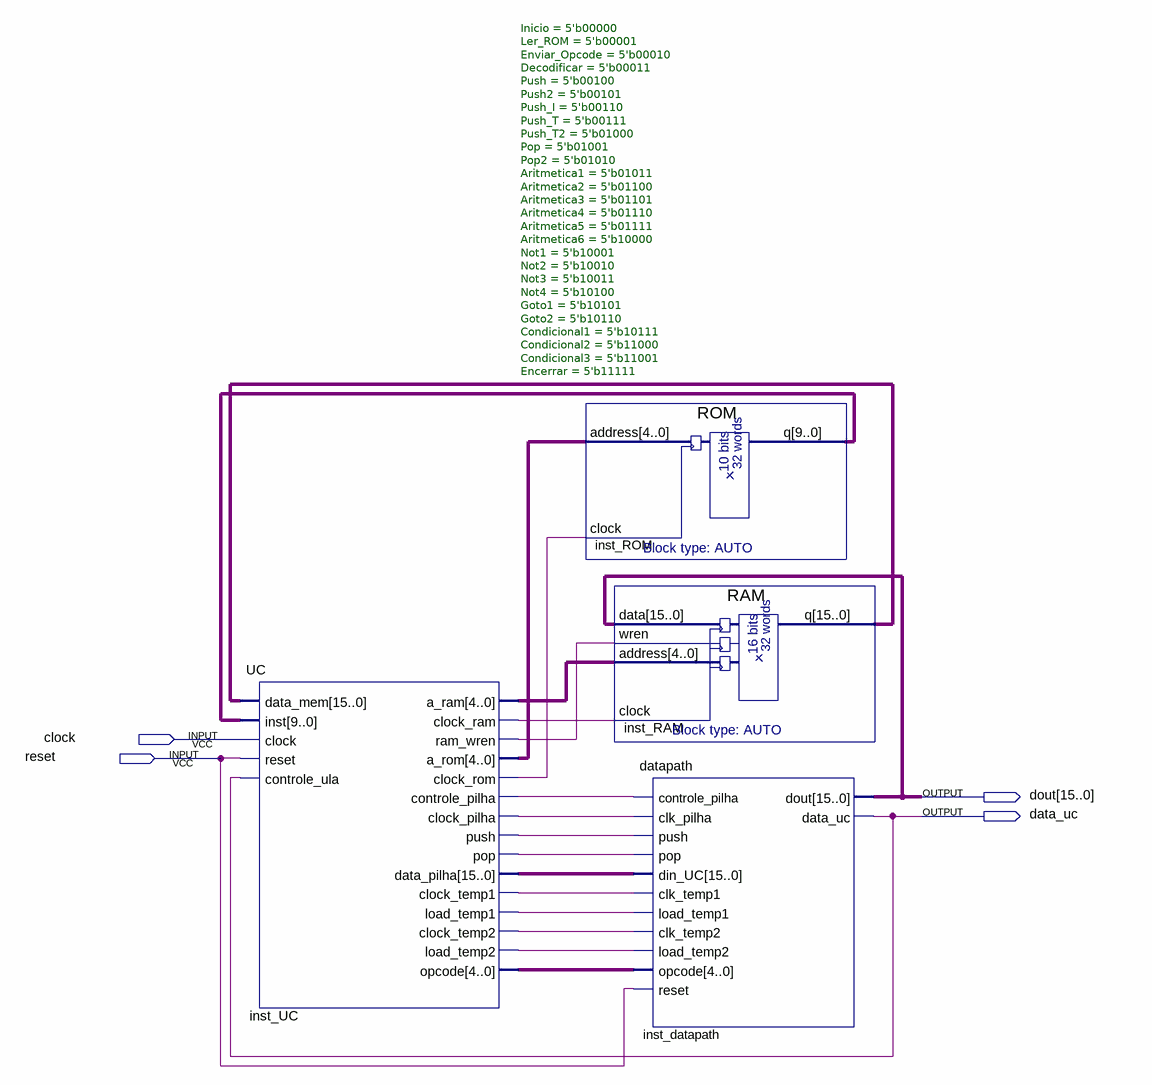
[diagram p0: schematic sheet]
// Quartus schematic processador_blocos.bdf as structural Verilog: 4 symbols, 4 pins
module processador_blocos (
  input  clock,
  input  reset,
  output [15:0] dout,
  output data_uc
);

  wire inst_UC_clock_pilha, inst_UC_clock_ram, inst_UC_clock_rom, inst_UC_clock_temp1, inst_UC_clock_temp2,
       inst_UC_controle_pilha, inst_UC_load_temp1, inst_UC_load_temp2, inst_UC_pop, inst_UC_push,
       inst_UC_ram_wren;
  wire [4:0] inst_UC_a_ram, inst_UC_a_rom, inst_UC_opcode;
  wire [9:0] inst_ROM_q;
  wire [15:0] inst_RAM_q, inst_UC_data_pilha;

  UC #(.Inicio(5'b00000), .Ler_ROM(5'b00001), .Enviar_Opcode(5'b00010), .Decodificar(5'b00011), .Push(5'b00100), .Push2(5'b00101), .Push_I(5'b00110), .Push_T(5'b00111), .Push_T2(5'b01000), .Pop(5'b01001), .Pop2(5'b01010), .Aritmetica1(5'b01011), .Aritmetica2(5'b01100), .Aritmetica3(5'b01101), .Aritmetica4(5'b01110), .Aritmetica5(5'b01111), .Aritmetica6(5'b10000), .Not1(5'b10001), .Not2(5'b10010), .Not3(5'b10011), .Not4(5'b10100), .Goto1(5'b10101), .Goto2(5'b10110), .Condicional1(5'b10111), .Condicional2(5'b11000), .Condicional3(5'b11001), .Encerrar(5'b11111)) inst_UC (
    .data_mem(inst_RAM_q), .inst(inst_ROM_q), .clock(clock), .reset(reset), .controle_ula(data_uc),
    .a_ram(inst_UC_a_ram), .clock_ram(inst_UC_clock_ram), .ram_wren(inst_UC_ram_wren), .a_rom(inst_UC_a_rom),
    .clock_rom(inst_UC_clock_rom), .controle_pilha(inst_UC_controle_pilha),
    .clock_pilha(inst_UC_clock_pilha), .push(inst_UC_push), .pop(inst_UC_pop),
    .data_pilha(inst_UC_data_pilha), .clock_temp1(inst_UC_clock_temp1), .load_temp1(inst_UC_load_temp1),
    .clock_temp2(inst_UC_clock_temp2), .load_temp2(inst_UC_load_temp2), .opcode(inst_UC_opcode));
  ROM inst_ROM (.address(inst_UC_a_rom), .clock(inst_UC_clock_rom), .q(inst_ROM_q));
  RAM inst_RAM (
    .data(dout), .wren(inst_UC_ram_wren), .address(inst_UC_a_ram), .clock(inst_UC_clock_ram), .q(inst_RAM_q));
  datapath inst_datapath (
    .reset(reset), .clk_pilha(inst_UC_clock_pilha), .clk_temp2(inst_UC_clock_temp2),
    .load_temp2(inst_UC_load_temp2), .load_temp1(inst_UC_load_temp1), .clk_temp1(inst_UC_clock_temp1),
    .push(inst_UC_push), .pop(inst_UC_pop), .controle_pilha(inst_UC_controle_pilha),
    .din_UC(inst_UC_data_pilha), .opcode(inst_UC_opcode), .data_uc(data_uc), .dout(dout));
endmodule
